# EAGLE design EVE v0-3 (EAGLE 6.1)
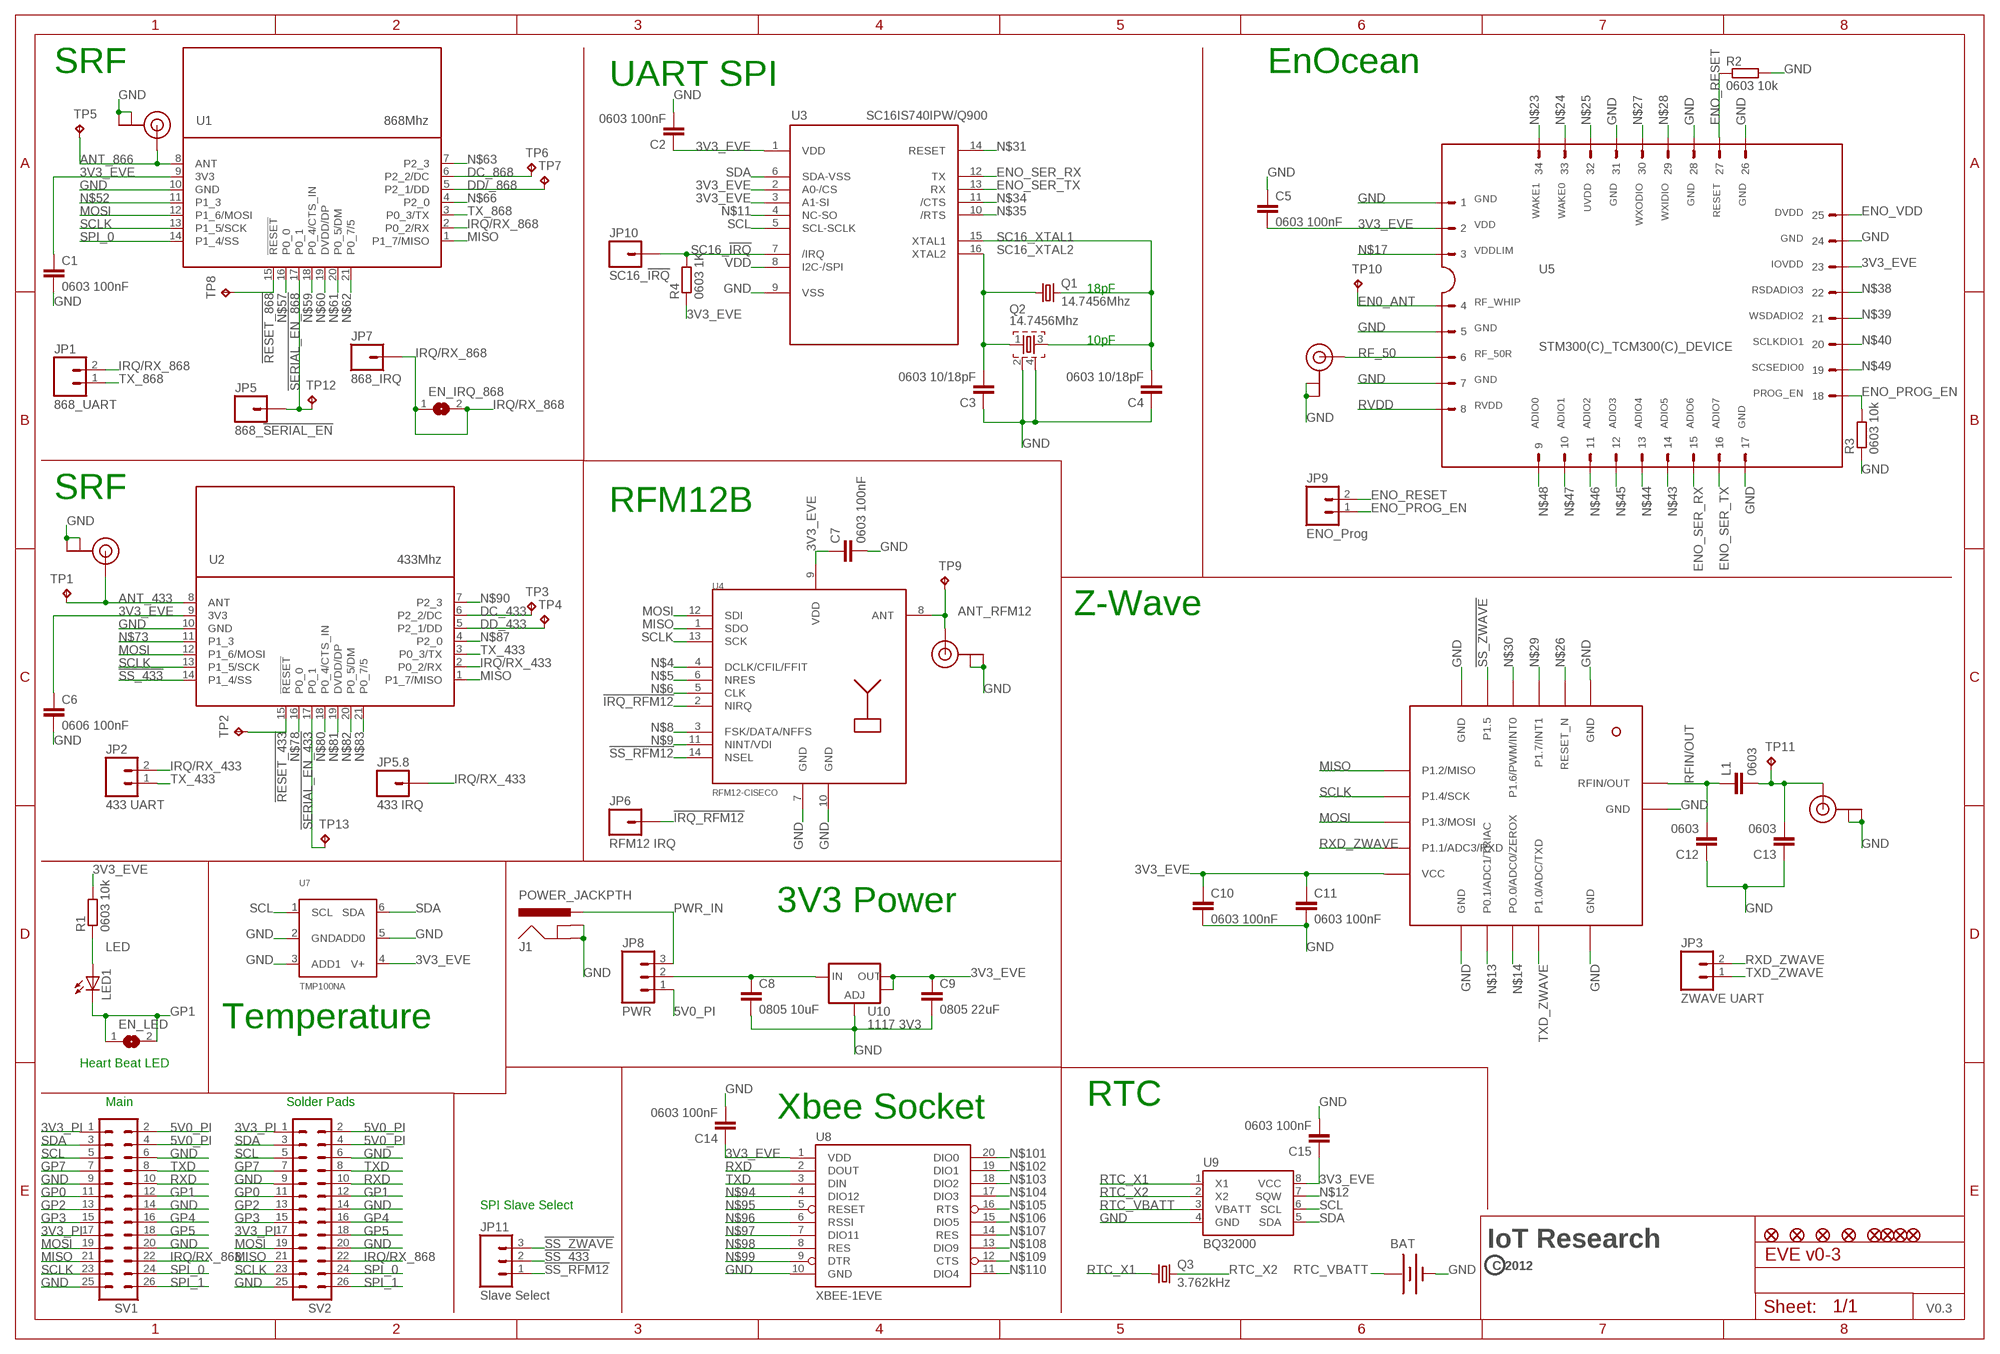
[diagram p0: schematic, sheet 1]

## Parts
BAT  BATTERY12MM-BK-855  [BATTCON_12MM-BK-885]
C1  0603 100nF  C-EUC0603K-SMALL  [C0603K-SMALL]
C2  0603 100nF  C-EUC0603K-SMALL  [C0603K-SMALL]
C3  0603 10/18pF  C-EUC0603K-SMALL  [C0603K-SMALL]
C4  0603 10/18pF  C-EUC0603K-SMALL  [C0603K-SMALL]
C5  0603 100nF  C-EUC0603K-SMALL  [C0603K-SMALL]
C6  0606 100nF  C-EUC0603K-SMALL  [C0603K-SMALL]
C7  0603 100nF  C-EUC0603K-SMALL  [C0603K-SMALL]
C8  0805 10uF  C-EUC0805  [C0805]
C9  0805 22uF  C-EUC0805  [C0805]
C10  0603 100nF  C-EUC0603K-SMALL  [C0603K-SMALL]
C11  0603 100nF  C-EUC0603K-SMALL  [C0603K-SMALL]
C12  0603  C-EUC0603K-SMALL  [C0603K-SMALL]
C13  0603  C-EUC0603K-SMALL  [C0603K-SMALL]
C14  0603 100nF  C-EUC0603K-SMALL  [C0603K-SMALL]
C15  0603 100nF  C-EUC0603K-SMALL  [C0603K-SMALL]
EN_IRQ_868  SJ  [SJ]
EN_LED  SJ  [SJ]
J1  POWER_JACKPTH  [POWER_JACK_PTH]
JP1  868_UART  M021X02_NO_SILK  [1X02_NO_SILK]
JP2  433 UART  M021X02_NO_SILK  [1X02_NO_SILK]
JP3  ZWAVE UART  M021X02_NO_SILK  [1X02_NO_SILK]
JP4  FIDUCIAL1X2-STOP  [FIDUCIAL-1X2-STOP]
JP5  868_!SERIAL_EN  M01SMDNS  [1X01NS]
JP5.8  433 IRQ  M01SMDNS  [1X01NS]
JP6  RFM12 IRQ  M01SMDNS  [1X01NS]
JP7  868_IRQ  M01SMDNS  [1X01NS]
JP8  PWR  M031X03_NO_SILK  [1X03_NO_SILK]
JP9  ENO_Prog  M021X02_NO_SILK  [1X02_NO_SILK]
JP10  SC16_!IRQ  M01SMDNS  [1X01NS]
JP11  Slave Select  M031X03_NO_SILK  [1X03_NO_SILK]
JP12  FIDUCIAL1X2-STOP  [FIDUCIAL-1X2-STOP]
JP13  FIDUCIAL1X2-STOP  [FIDUCIAL-1X2-STOP]
JP14  FIDUCIAL1X2-STOP  [FIDUCIAL-1X2-STOP]
JP15  FIDUCIAL1X2-STOP  [FIDUCIAL-1X2-STOP]
JP16  FIDUCIAL1X2-STOP  [FIDUCIAL-1X2-STOP]
JP17  FIDUCIAL1X2-STOP  [FIDUCIAL-1X2-STOP]
JP18  FIDUCIAL1X2-STOP  [FIDUCIAL-1X2-STOP]
L1  0603  C-EUC0603K-SMALL  [C0603K-SMALL]
LED1  LEDREVERSE  [LED-REVERSE]
Q1  14.7456Mhz  CRYSTAL10.5X4.8  [CRYSTAL-SMD-10.5X4.8-2PIN]
Q2  14.7456Mhz  CRYSTAL-SMD  [CRYSTAL-SMD-ABM8G]
Q3  3.762kHz  MC-306  [MC-306]
R1  0603 10k  R-EU_0603K-SMALL  [C0603K-SMALL]
R2  0603 10k  R-EU_0603K-SMALL  [C0603K-SMALL]
R3  0603 10k  R-EU_0603K-SMALL  [C0603K-SMALL]
R4  0603 1K  R-EU_0603K-SMALL  [C0603K-SMALL]
SV1  MA13-2-NO-SILK  [MA13-2-NS]
SV2  MA13-2  [MA13-2]
TP1  TPPAD1-13  [P1-13]
TP2  TPB1,27  [B1,27]
TP3  TPB1,27  [B1,27]
TP4  TPB1,27  [B1,27]
TP5  TPPAD1-13  [P1-13]
TP6  TPB1,27  [B1,27]
TP7  TPB1,27  [B1,27]
TP8  TPB1,27  [B1,27]
TP9  TPPAD1-13  [P1-13]
TP10  TPPAD1-13  [P1-13]
TP11  TPPAD1-13  [P1-13]
TP12  TPB1,27  [B1,27]
TP13  TPB1,27  [B1,27]
U1  868Mhz  SRFSRF-LANDING  [SRF-LANDING]
U2  433Mhz  SRFSRF-LANDING-NO-ANT  [SRF-LANDING-NO-ANT]
U3  SC16IS740IPW/Q900  [TSSOP-16]
U4  RFM12-CISECO  [RFM-CISECO]
U5  STM300(C)_TCM300(C)_DEVICE  [STM300(C)_TCM300(C)_FOOTPRINT]
U6  ZWAVE-ZM3102N  [ZWAVE-ZM3102N]
U7  TMP100NA  TMP100"  [SOT-23-6]
U8  XBEE-1EVE  [XBEE-EVE]
U9  BQ32000  DS1307SO8  [SO08]
U10  1117 3V3  V_REG_LM1117SOT223  [SOT223]
U11  U.FL 868  U.FL  [U.FL]
U12  U.FL EnOcean  U.FL  [U.FL]
U13  U.FL 433  U.FL  [U.FL]
U14  U.FL RFM12B  U.FL  [U.FL]
U15  U.FL Z-Wave  U.FL  [U.FL]

## Nets
3V3_EVE [3V3_EVE]: C1.1 C2.1 C5.2 C6.1 C7.1 C9.1 C10.1 C11.1 C14.1 C15.1 R1.2 R4.1 U1.9(3V3) U2.9(3V3) U3.1(VDD) U3.2(A0-/CS) U3.3(A1-SI) U4.9(VDD) U5.2 U5.23 U6.11(VCC) U7.4(V+) U8.1(VDD) U9.8(VCC) U10.2(OUT) U10.4(OUT)
3V3_PI [3V3_PI]: SV1.1 SV1.17 SV2.1 SV2.17
5V0_PI [5V0_PI]: JP8.1 SV1.2 SV1.4 SV2.2 SV2.4
!IRQ_RFM12: JP6.1 U4.2(NIRQ)
!RESET_433: TP2.TP U2.15(!RESET)
!RESET_868: TP8.TP U1.15(!RESET)
!SERIAL_EN_433: TP13.TP U2.17(P0_1)
!SERIAL_EN_868: JP5.1 TP12.TP U1.17(P0_1)
!SS_433: JP11.2 U2.14(P1_4/SS)
!SS_RFM12: JP11.1 U4.14(NSEL)
!SS_ZWAVE: JP11.3 U6.5(P1.5)
ANT_433: TP1.TP U2.8(ANT) U13.P$3(SIGNAL)
ANT_866: TP5.TP U1.8(ANT) U11.P$3(SIGNAL)
ANT_RFM12: TP9.TP U4.8(ANT) U14.P$3(SIGNAL)
DC_433: TP3.TP U2.6(P2_2/DC)
DC_868: TP6.TP U1.6(P2_2/DC)
DD/_868: TP7.TP U1.5(P2_1/DD)
DD_433: TP4.TP U2.5(P2_1/DD)
EN0_ANT: TP10.TP U5.4
ENO_PROG_EN: JP9.1 R3.2 U5.18
ENO_RESET: JP9.2 R2.1 U5.27
ENO_SER_RX: U3.12(TX) U5.15
ENO_SER_TX: U3.13(RX) U5.16
ENO_VDD: U5.25
GND: BAT.GND(-) C1.2 C2.2 C3.1 C4.1 C5.1 C6.2 C7.2 C8.2 C9.2 C10.2 C11.2 C12.1 C13.1 C14.2 C15.2 J1.GND J1.GNDBREAK Q2.2 Q2.4 R2.2 R3.1 SV1.6 SV1.9 SV1.14 SV1.20 SV1.25 SV2.6 SV2.9 SV2.14 SV2.20 SV2.25 U1.10(GND) U2.10(GND) U3.9(VSS) U4.7(GND) U4.10(GND) U5.1 U5.5 U5.7 U5.17 U5.24 U5.26 U5.28 U5.31 U6.1(GND) U6.6(GND) U6.12(GND) U6.16(GND) U6.17(GND) U7.2(GND) U7.3(ADD1) U7.5(ADD0) U8.10(GND) U9.4(GND) U10.1(ADJ) U11.P$1(GND) U11.P$2(GND) U12.P$1(GND) U12.P$2(GND) U13.P$1(GND) U13.P$2(GND) U14.P$1(GND) U14.P$2(GND) U15.P$1(GND) U15.P$2(GND)
GP0: SV1.11 SV2.11
GP1: EN_LED.1 EN_LED.2 LED1.C SV1.12 SV2.12
GP2: SV1.13 SV2.13
GP3: SV1.15 SV2.15
GP4: SV1.16 SV2.16
GP5: SV1.18 SV2.18
GP7: SV1.7 SV2.7
IRQ/RX_433: JP2.2 JP5.8.1 U2.2(P0_2/RX)
IRQ/RX_868: EN_IRQ_868.1 EN_IRQ_868.2 JP1.2 JP7.1 SV1.22 SV2.22 U1.2(P0_2/RX)
LED: LED1.A R1.1
MISO: SV1.21 SV2.21 U1.1(P1_7/MISO) U2.1(P1_7/MISO) U4.1(SDO) U6.7(P1.2/MISO)
MOSI: SV1.19 SV2.19 U1.12(P1_6/MOSI) U2.12(P1_6/MOSI) U4.12(SDI) U6.9(P1.3/MOSI)
N$3: C13.2 L1.2 TP11.TP U15.P$3(SIGNAL)
N$4: U4.4(DCLK/CFIL/FFIT)
N$5: U4.6(NRES)
N$6: U4.5(CLK)
N$8: U4.3(FSK/DATA/NFFS)
N$9: U4.11(NINT/VDI)
N$11: U3.4(NC-SO)
N$12: U9.7(SQW)
N$13: U6.13(P0.1/ADC1/TRIAC)
N$14: U6.14(PO.0/ADC0/ZEROX)
N$17: U5.3
N$23: U5.34
N$24: U5.33
N$25: U5.32
N$26: U6.2(RESET_N)
N$27: U5.30
N$28: U5.29
N$29: U6.3(P1.7/INT1)
N$30: U6.4(P1.6/PWM/INT0)
N$31: U3.14(RESET)
N$34: U3.11(/CTS)
N$35: U3.10(/RTS)
N$38: U5.22
N$39: U5.21
N$40: U5.20
N$43: U5.14
N$44: U5.13
N$45: U5.12
N$46: U5.11
N$47: U5.10
N$48: U5.9
N$49: U5.19
N$52: U1.11(P1_3)
N$57: U1.16(P0_0)
N$59: U1.18(P0_4/CTS_IN)
N$60: U1.19(DVDD/DP)
N$61: U1.20(P0_5/DM)
N$62: U1.21(P0_7/5)
N$63: U1.7(P2_3)
N$66: U1.4(P2_0)
N$73: U2.11(P1_3)
N$78: U2.16(P0_0)
N$80: U2.18(P0_4/CTS_IN)
N$81: U2.19(DVDD/DP)
N$82: U2.20(P0_5/DM)
N$83: U2.21(P0_7/5)
N$87: U2.4(P2_0)
N$90: U2.7(P2_3)
N$94: U8.4(DIO12)
N$95: U8.5(RESET)
N$96: U8.6(RSSI)
N$97: U8.7(DIO11)
N$98: U8.8(RES)
N$99: U8.9(DTR)
N$101: U8.20(DIO0)
N$102: U8.19(DIO1)
N$103: U8.18(DIO2)
N$104: U8.17(DIO3)
N$105: U8.16(RTS)
N$106: U8.15(DIO5)
N$107: U8.14(RES)
N$108: U8.13(DIO9)
N$109: U8.12(CTS)
N$110: U8.11(DIO4)
PWR_IN [PWR_IN]: J1.PWR JP8.3
RF_50: U5.6 U12.P$3(SIGNAL)
RFIN/OUT: C12.2 L1.1 U6.18(RFIN/OUT)
RTC_VBATT: BAT.PWR@2(+) U9.3(VBATT)
RTC_X1: Q3.1 U9.1(X1)
RTC_X2: Q3.4 U9.2(X2)
RVDD: U5.8
RXD: SV1.10 SV2.10 U8.2(DOUT)
RXD_ZWAVE: JP3.2 U6.10(P1.1/ADC3/RXD)
SC16_!IRQ: JP10.1 R4.2 U3.7(/IRQ)
SC16_XTAL1: C4.2 Q1.P$2 Q2.3 U3.15(XTAL1)
SC16_XTAL2: C3.2 Q1.P$1 Q2.1 U3.16(XTAL2)
SCL: SV1.5 SV2.5 U3.5(SCL-SCLK) U7.1(SCL) U9.6(SCL)
SCLK: SV1.23 SV2.23 U1.13(P1_5/SCK) U2.13(P1_5/SCK) U4.13(SCK) U6.8(P1.4/SCK)
SDA: SV1.3 SV2.3 U3.6(SDA-VSS) U7.6(SDA) U9.5(SDA)
SPI_0: SV1.24 SV2.24 U1.14(P1_4/SS)
SPI_1: SV1.26 SV2.26
TX_433: JP2.1 U2.3(P0_3/TX)
TX_868: JP1.1 U1.3(P0_3/TX)
TXD: SV1.8 SV2.8 U8.3(DIN)
TXD_ZWAVE: JP3.1 U6.15(P1.0/ADC/TXD)
VCC_EVE [VCC_EVE]: C8.1 JP8.2 U10.3(IN)
VDD: U3.8(I2C-/SPI)

## Notes on the sheet
- SRF | EnOcean
- UART SPI
- 18pF
- 10pF
- SRF
- RFM12B
- Z-Wave
- 3V3 Power
- Temperature
- Heart Beat LED
- Main | Solder Pads | RTC
- Xbee Socket
- SPI Slave Select
- IoT Research
- C 2012
- V0.3

## Library data of the parts
BAT = CISECO eaglecad designs:BATTERY: Battery Holders Various common sizes : AA, AAA, 20mm coin cell and 12mm coin cell.
C1-C15 L1 = CISECO eaglecad designs:C-EU: CAPACITOR, European symbol
EN_IRQ_868 EN_LED = jumper:SJ: SMD solder JUMPER
J1 = SparkFunJan12:POWER_JACK: Power Jack This is the standard 5.5mm barrel jack for power. The PTH is the most common, proven, reliable, footprint. All others are experimental. The Slot footprint only works if the mill layer is transmitted to the PCB fab house so be warned. Spark Fun Electronics SKU : PRT-00119. Mating wall wart : TOL-00298 (and others)
JP1-JP3 JP9 = SparkFunJan12:M02: Header 2 Standard 2-pin 0.1" header. Use with straight break away headers (SKU : PRT-00116), right angle break away headers (PRT-00553), swiss pins (PRT-00743), machine pins (PRT-00117), and female headers (PRT-00115). Molex polarized connector foot print use with SKU : PRT-08233 with associated crimp pins and housings.
JP4 JP12-JP18 = CISECO eaglecad designs:FIDUCIAL: Fiducial Alignment Points Various fiducial points for machine vision alignment.
JP5 JP5.8 JP6 JP7 JP10 = SparkFunJan12:M01: Header 1 Standard 1-pin 0.1" header. Use with straight break away headers (SKU : PRT-00116), right angle break away headers (PRT-00553), swiss pins (PRT-00743), machine pins (PRT-00117), and female headers (PRT-00115).
JP8 JP11 = SparkFunJan12:M03: Header 3 Standard 3-pin 0.1" header. Use with straight break away headers (SKU : PRT-00116), right angle break away headers (PRT-00553), swiss pins (PRT-00743), machine pins (PRT-00117), and female headers (PRT-00115). Molex polarized connector foot print use with SKU : PRT-08232 with associated crimp pins and housings.
LED1 = CISECO eaglecad designs:LED: LEDs Standard schematic elements and footprints for 5mm, 3mm, 1206, and 0603 sized LEDs. 5mm - Spark Fun Electronics SKU : COM-00529 (and others)
Q1 = CISECO eaglecad designs:CRYSTAL: Crystals Various standard crystals. Proven footprints. Spark Fun Electronics SKU : COM-00534
Q2 = CISECO eaglecad designs:CRYSTAL-SMD
Q3 = crystal:MC-306: kHz RANGE CRYSTAL UNIT SMD Source: MC-306_405_406_E07X.PDF Homepage <http://www.epsontoyocom.co.jp>; MPN: MC-306 60.0KHZ 100PPM ,12.5PF; OC_FARNELL: 1278040; OC_NEWARK: 31M5576
R1-R4 = CISECO eaglecad designs:R-EU_: RESISTOR, European symbol
SV1 = CISECO eaglecad designs:MA13-2: PIN HEADER
SV2 = CISECO eaglecad designs:MA13-2: PIN HEADER; OC_FARNELL: unknown; OC_NEWARK: unknown
TP1-TP13 = testpad:TP: Test pad
U1 U2 = Ciseco Footprints:SRF: SRF Wireless UART Serial Data Module. www.ciseco.co.uk
U3 = CISECO eaglecad designs:SC16IS740
U4 = Pollin_RFMxx:RFM12
U5 = STM300(C)_TCM300(C)_Eagle_Footprint:STM300(C)_TCM300(C)_DEVICE
U6 = CISECO eaglecad designs:ZWAVE-ZM3102N
U7 = CISECO eaglecad designs:TMP100
U8 = SparkFunJan12:XBEE-1
U9 = SparkFunJan12:DS1307
U10 = SparkFunJan12:V_REG_LM1117: Voltage Regulator LM1117 Standard adjustable voltage regulator but in SMD form. Spark Fun Electronics SKU : COM-00595
U11-U15 = CISECO eaglecad designs:U.FL

## Net classes
0 default: width 0.15 mm, drill 0.3 mm
1 3V3_EVE: width 0.254 mm, drill 0.3 mm
2 VCC_EVE: width 0.61 mm, drill 0.4 mm
3 5V0_PI: width 0.406 mm, drill 0.4 mm
4 3V3_PI: width 0.254 mm, drill 0.4 mm
5 PWR_IN: width 0.61 mm
6 RTC_VBATT: width 0.254 mm

## Board
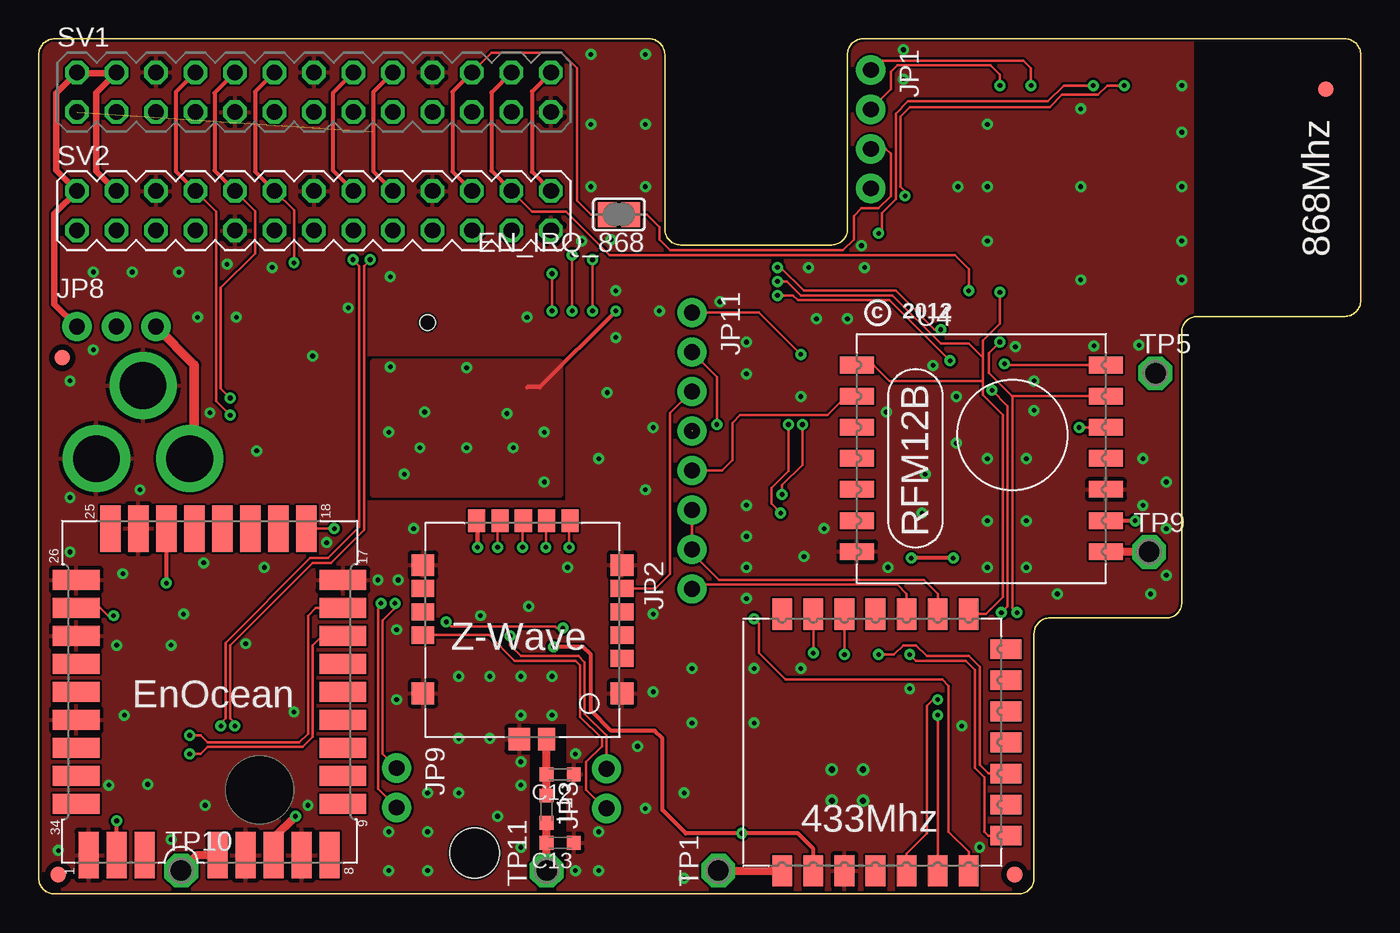
[diagram p1: board, top side]
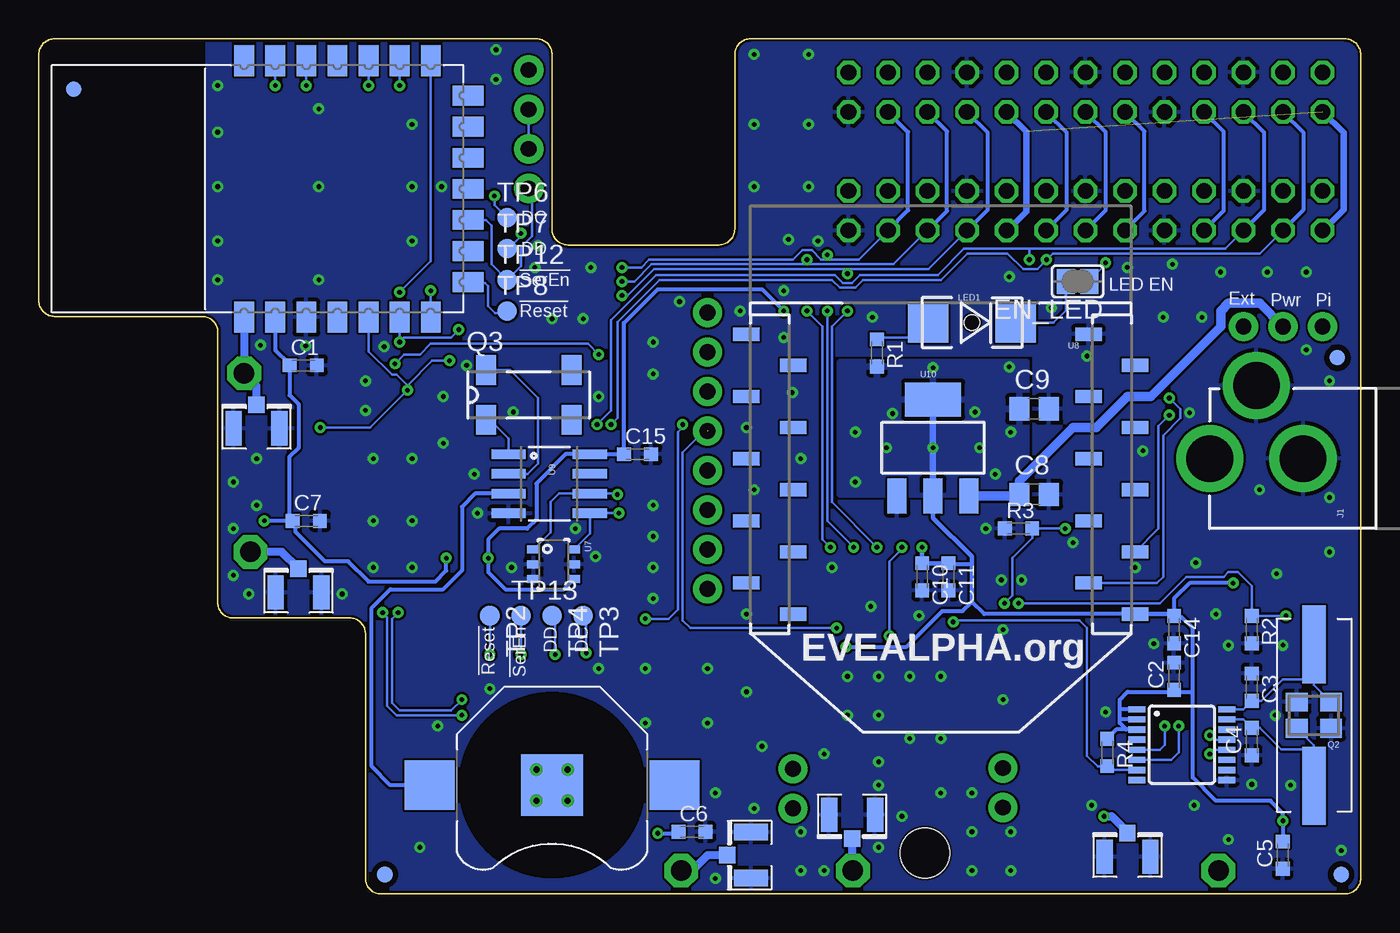
[diagram p2: board, bottom side, seen from below]

Size 85 x 55 mm. Coordinates in mm from the lower left corner, seen from the top.
Outline: 1,55 39.25,55 arc-90 40.25,54 40.25,42.75 arc90 41.25,41.75 51,41.75 arc90 52,42.75 52,54 arc-90 53,55 84,55 arc-90 85,54 85,38.15 arc-90 84,37.15 74.5,37.15 arc90 73.5,36.15 73.5,18.75 arc-90 72.5,17.75 65,17.75 arc90 64,16.75 64,1 arc-90 63,0 1,0 arc-90 0,1 0,54 arc-90 1,55
Copper layers (1*16): Top 0.035mm / dielectric 1mm / Bottom 0.035mm
Design rules: minimum track width 0.15mm, minimum drill 0.3mm, track to track 0.15mm, track to pad 0.15mm, pad to pad 0.15mm, via to via 0.15mm, smd to smd 0.15mm, copper to edge 0.15mm, drill to drill 0.15mm, minimum pad ring 10mil, minimum via ring 8mil, stop-mask expansion 4mil, vias tented up to drill 23mil, thermal gap 10mil
Holes 3.2 mm at 28.02,2.64
Holes 1 mm at 25,36.75
tRestrict: area 74.3,37.1 to 84.5,54.7; area 31.6,1.3 to 33.9,10.9
bRestrict: area 74.3,37.1 to 84.5,54.7; area 46,1 to 58,13

### Footprints (pad centres in the part's own frame; a part is rotated, then mirrored left to right if it is on the bottom)
BATTCON_12MM-BK-885 = smd 3.962 x 3.962: GND 0,0 | smd 3.2 x 3.2: PWR@1 -7.874,0; PWR@2 7.874,0
C0603K-SMALL = smd 0.889 x 0.889: 1 -0.875,0; 2 0.875,0
C0805 = smd 1.3 x 1.5: 1 -0.95,0; 2 0.95,0
SJ = smd 1.168 x 1.6: 1 -0.762,0; 2 0.762,0
POWER_JACK_PTH = drill 2.997 pad 4.318: GND 0,7.7; GNDBREAK 4.7,10.7; PWR 0,13.7
1X02_NO_SILK = drill 1.016 pad 1.88: 1 0,0; 2 2.54,0
FIDUCIAL-1X2-STOP = smd 1 x 1: 1 0,0
1X01NS = drill 1.016 pad 1.88: 1 0,0
1X03_NO_SILK = drill 1.016 pad 1.88: 1 0,0; 2 2.54,0; 3 5.08,0
LED-REVERSE = smd 2.6 x 2.6: A -2.8,0; C 2.8,0
CRYSTAL-SMD-10.5X4.8-2PIN = smd 5 x 1.5: P$1 -4.55,0; P$2 4.55,0
CRYSTAL-SMD-ABM8G = smd 1.4 x 1.2: 1 -1.1,-0.85; 2 1.1,-0.85; 3 1.1,0.85; 4 -1.1,0.85
MC-306 = smd 1.3 x 1.9: 1 -2.75,-1.6; 2 2.75,-1.6; 3 2.75,1.6; 4 -2.75,1.6
MA13-2-NS = drill 1.016 octagon: 1 -15.24,-1.27; 2 -15.24,1.27; 3 -12.7,-1.27; 4 -12.7,1.27; 5 -10.16,-1.27; 6 -10.16,1.27; 7 -7.62,-1.27; 8 -7.62,1.27; 9 -5.08,-1.27; 10 -5.08,1.27; 11 -2.54,-1.27; 12 -2.54,1.27; 13 0,-1.27; 14 0,1.27; 15 2.54,-1.27; 16 2.54,1.27; 17 5.08,-1.27; 18 5.08,1.27; 19 7.62,-1.27; 20 7.62,1.27; 21 10.16,-1.27; 22 10.16,1.27; 23 12.7,-1.27; 24 12.7,1.27; 25 15.24,-1.27; 26 15.24,1.27
MA13-2 = drill 1.016 octagon: 1 -15.24,-1.27; 2 -15.24,1.27; 3 -12.7,-1.27; 4 -12.7,1.27; 5 -10.16,-1.27; 6 -10.16,1.27; 7 -7.62,-1.27; 8 -7.62,1.27; 9 -5.08,-1.27; 10 -5.08,1.27; 11 -2.54,-1.27; 12 -2.54,1.27; 13 0,-1.27; 14 0,1.27; 15 2.54,-1.27; 16 2.54,1.27; 17 5.08,-1.27; 18 5.08,1.27; 19 7.62,-1.27; 20 7.62,1.27; 21 10.16,-1.27; 22 10.16,1.27; 23 12.7,-1.27; 24 12.7,1.27; 25 15.24,-1.27; 26 15.24,1.27
P1-13 = drill 1.321 pad 2.159 octagon: TP 0,0
B1,27 = smd 1.27 x 1.27: TP 0,0
SRF-LANDING = smd 2 x 1.27: 1 16.2,2; 2 16.2,4; 3 16.2,6; 4 16.2,8; 5 16.2,10; 6 16.2,12; 7 16.2,14; 8 -0.3,14; 9 -0.3,12; 10 -0.3,10; 11 -0.3,8; 12 -0.3,6; 13 -0.3,4; 14 -0.3,2 | smd 1.27 x 2: 15 1.95,-0.4; 16 3.95,-0.4; 17 5.95,-0.4; 18 7.95,-0.4; 19 9.95,-0.4; 20 11.95,-0.4; 21 13.95,-0.4
SRF-LANDING-NO-ANT = smd 2 x 1.27: 1 16.2,2; 2 16.2,4; 3 16.2,6; 4 16.2,8; 5 16.2,10; 6 16.2,12; 7 16.2,14; 8 -0.3,14; 9 -0.3,12; 10 -0.3,10; 11 -0.3,8; 12 -0.3,6; 13 -0.3,4; 14 -0.3,2 | smd 1.27 x 2: 15 1.95,-0.4; 16 3.95,-0.4; 17 5.95,-0.4; 18 7.95,-0.4; 19 9.95,-0.4; 20 11.95,-0.4; 21 13.95,-0.4
TSSOP-16 = smd 0.4 x 1.1: 1 -2.275,-2.9; 2 -1.625,-2.9; 3 -0.975,-2.9; 4 -0.325,-2.9; 5 0.325,-2.9; 6 0.975,-2.9; 7 1.625,-2.9; 8 2.275,-2.9; 9 2.275,2.9; 10 1.625,2.9; 11 0.975,2.9; 12 0.325,2.9; 13 -0.325,2.9; 14 -0.975,2.9; 15 -1.625,2.9; 16 -2.275,2.9
RFM-CISECO = smd 2.184 x 1.067: 1 0,14; 2 0,12; 3 0,10; 4 0,8; 5 0,6; 6 0,4; 7 0,2; 8 16,2; 9 16,4; 10 16,6; 11 16,8; 12 16,10; 13 16,12; 14 16,14
STM300(C)_TCM300(C)_FOOTPRINT = smd 3 x 1.3: 1 21.5,1.7; 2 21.5,3.5; 3 21.5,5.3; 4 21.5,10; 5 21.5,11.8; 6 21.5,13.6; 7 21.5,15.4; 8 21.5,17.2; 18 0.5,15.7; 19 0.5,13.9; 20 0.5,12.1; 21 0.5,10.3; 22 0.5,8.5; 23 0.5,6.7; 24 0.5,4.9; 25 0.5,3.1 | smd 1.3 x 3: 9 18.2,18.05; 10 16.4,18.05; 11 14.6,18.05; 12 12.8,18.05; 13 11,18.05; 14 9.2,18.05; 15 7.4,18.05; 16 5.6,18.05; 17 3.8,18.05; 26 3.8,0.9; 27 5.6,0.9; 28 7.4,0.9; 29 9.2,0.9; 30 11,0.9; 31 12.8,0.9; 32 14.6,0.9; 33 16.4,0.9; 34 18.2,0.9
ZWAVE-ZM3102N = smd 1.4 x 1.45: 1 11.8,13.5; 6 3.55,13.5; 12 3.55,0.7; 16 11.8,0.7 | smd 1.1 x 1.45: 2 9.55,13.5; 3 8.05,13.5; 4 6.55,13.5; 5 5.05,13.5; 13 5.05,0.7; 14 6.55,0.7; 15 8.05,0.7 | smd 1.45 x 1.1: 7 0.7,10.15; 8 0.7,8.65; 9 0.7,7.15; 10 0.7,5.65; 11 0.7,4.15; 18 14.75,8.65 | smd 1.45 x 1.4: 17 14.75,6.9
SOT-23-6 = smd 0.51 x 0.8: 1 -0.95,-1.3; 2 0,-1.3; 3 0.95,-1.3; 4 0.95,1.3; 5 0,1.3; 6 -0.95,1.3
XBEE-EVE = smd 1.7 x 0.85: 1 -12.5,20; 2 -9.5,18; 3 -12.5,16; 4 -9.5,14; 5 -12.5,12; 6 -9.5,10; 7 -12.5,8; 8 -9.5,6; 9 -12.5,4; 10 -9.5,2; 11 12.5,2; 12 9.5,4; 13 12.5,6; 14 9.5,8; 15 12.5,10; 16 9.5,12; 17 12.5,14; 18 9.5,16; 19 12.5,18; 20 9.5,20
SO08 = smd 0.61 x 2.21: 1 -1.905,-2.616; 2 -0.635,-2.616; 3 0.635,-2.616; 4 1.905,-2.616; 5 1.905,2.616; 6 0.635,2.616; 7 -0.635,2.616; 8 -1.905,2.616
SOT223 = smd 1.219 x 2.235: 1 -2.311,-3.099; 2 0,-3.099; 3 2.311,-3.099 | smd 3.6 x 2.2: 4 0,3.099
U.FL = smd 2.2 x 1.05: P$1 0,1.475; P$2 0,-1.475 | smd 1.05 x 1.05: P$3 1.525,0

### Placement (x,y rotation side)
BAT  52,7 180 bottom
C1  68,34 0 bottom
C2  12,14 90 bottom
C3  7,13.3 270 bottom
C4  7,9.8 90 bottom
C5  5,2.5 90 bottom
C6  43,4 0 bottom
C7  67.8,24 0 bottom
C8  21,25.7 0 bottom
C9  21,31.2 0 bottom
C10  28.2,20.4 270 bottom
C11  26.5,20.4 270 bottom
C12  33.52,7.7 180 top
C13  33.52,3.3 180 top
C14  12,17 270 bottom
C15  46.5,28.29 0 bottom
EN_IRQ_868  37.3,43.7 180 top
EN_LED  18.2,39.4 180 bottom
J1  -4,28 90 bottom
JP1  53.5,53 270 top
JP2  42,19.62 90 top
JP3  36.5,5.5 90 top
JP4  1.25,1.25 0 top
JP5  53.5,45.38 0 top
JP5.8  42,24.7 0 top
JP6  42,27.24 0 top
JP7  53.5,47.92 0 top
JP8  2.45,36.5 0 top
JP9  23,8.1 270 top
JP10  42,29.78 0 top
JP11  42,37.4 270 top
JP12  82.75,51.75 0 top
JP13  1.5,34.5 0 bottom
JP14  62.75,1.25 0 bottom
JP15  62.75,1.25 0 top
JP16  1.25,1.25 0 bottom
JP17  1.5,34.5 0 top
JP18  82.75,51.75 0 bottom
L1  32.65,5.45 270 top
LED1  25,36.75 0 bottom
Q1  3,11.5 270 bottom
Q2  3,11.5 180 bottom
Q3  53.5,32.1 0 bottom
R1  31.1,34.8 270 bottom
R2  7,17 270 bottom
R3  22,23.5 0 bottom
R4  16.3,9.1 270 bottom
SV1  17.69,51.57 0 top
SV2  17.69,43.95 0 top
TP1  43.7,1.5 90 top
TP2  56,17.9 270 bottom
TP3  50,17.9 270 bottom
TP4  52,17.9 270 bottom
TP5  71.8,33.5 0 top
TP6  54.9,43.5 0 bottom
TP7  54.9,41.5 0 bottom
TP8  54.9,37.5 0 bottom
TP9  71.4,22 0 top
TP10  9.15,1.5 0 top
TP11  32.65,1.5 90 top
TP12  54.9,39.5 0 bottom
TP13  54,17.9 0 bottom
U1  57.8,37.4 90 bottom
U2  61.8,1.8 90 top
U3  11.5,9.6 270 bottom
U4  52.62,20.02 0 top
U5  1.5,24 270 top
U6  24,24.7 270 top
U7  51.9,21.2 270 bottom
U8  27,38 180 bottom
U9  52.18,26.38 270 bottom
U10  27.5,28.7 0 bottom
U11  71,29.95 90 bottom
U12  15,2.4 90 bottom
U13  39.2,2.5 180 bottom
U14  68.3,19.4 90 bottom
U15  32.7,5.1 270 bottom
U$8  [EVE1]  25,37.5 0 top

### Tracks (layer width: path | path; a pad name or v marks a point on that pad's centre or on a via)
3V3_EVE  (via drill 0.3)
  Top 0.254: U2.9 49.8,2.9 48.8,3.9 v45.2,3.9 41.6,3.9 40.1,5.4 40.1,10 39.6,10.5 36.8,10.5 35.5,11.8 35.5,15.4 35,15.9 v33.1,15.9 | U5.2 v5,4.7 | U4.9 70.48,24.02 v70.5,24 | v58.8,21.6 v56.1,21.6 | v37.1,37.5 32.2,32.6 31.4,32.6 | U5.23 v8.2,20
  Top 0.305: U6.11 28.2,23.95 v28.2,22.3
  Bottom 0.254: C5.2 v5,4.7 5,5.2 5.8,6 9.3,6 10.8,7.5 10.8,13 | C7.1 v70.5,24 | U8.1 24.2,18 25,18.8 25.6,18.2 26.9,18.2 29.2,15.9 v33.1,15.9 | 10.8,13 10.8,17.1 11.5,17.8 12,17.8 C14.1 12,19 11,20 v8.2,20 | U1.9 69.8,35 68.88,34.08 C1.1 68.88,32.08 68.3,31.5 68.3,28.7 68.9,28.1 68.9,24 C7.1 | C7.1 68.5,23.82 68.5,23.3 66.6,21.4 65.1,21.4 63.8,20.1 59.5,20.1 58.8,20.8 v58.8,21.6 | U7.4 51.25,19.6 55,19.6 56.1,20.7 v56.1,21.6 56.1,22.8 55.4,23.5 53.6,23.5 53,24.1 53,26.4 51.12,28.29 U9.8 C15.1 47.38,36.73 45.2,38.9 38.5,38.9 v37.1,37.5 | 15.5,11.2 15.5,11 15.07,10.57 | 15.5,11.2 15.5,11.9 | 15.5,11.9 15.5,12.5 15,13 12,13 | 12,13 10.8,13 | C2.1 12,13 | 15.07,10.57 15.7,10.57 R4.1 | U3.3 15.07,10.57 | U3.2 15.47,11.22 15.5,11.2 | 25,21.2 26.4,21.2 26.48,21.27 C11.1 | U3.1 15.47,11.88 15.5,11.9 | v45.2,3.9 43.98,3.9 C6.1
  Bottom 0.305: U8.1 12.12,18 C14.1 | C11.1 C10.1 v28.2,22.3 | U10.2 27.5,24.2 25,21.7 25,21.2 25,18.8
  Bottom 0.406: U10.4 27.5,25.7
  other vias: 27.5,28.7 24.8,31 30.1,30.9 27.5,33.85 23.5,27 22.5,29.7 22.6,33.9 32.5,29.7 32.5,26.5 30.5,28.7 24.5,28.7
  pour Bottom: 21.5,25.7 33.5,25.7 33.5,34.2 21.5,34.2
  pour Top: 33.5,25.7 21.5,25.7 21.5,34.2 33.5,34.2
3V3_PI  (1 unrouted)
  Bottom 0.406: SV1.1 1.1,48.95 1.1,44.03 SV2.1 | SV2.17 22.72,42.68 21.5,43.9 21.5,49.03 SV1.17
5V0_PI
  Top 0.406: JP8.1 1,37.95 1,43.77 SV2.2 1.1,46.57 1.1,51.49 SV1.2 2.49,52.8 4.95,52.8 SV1.4 3.7,51.55 3.7,46.5 SV2.4
!IRQ_RFM12
  Top 0.15: U4.2 52.6,32 51.9,32 50.7,30.8 45.1,30.8 44.6,30.3 44.6,27.9 43.94,27.24 JP6.1
!RESET_433  (via drill 0.3)
  Top 0.15: U2.15 61.05,3.75 60.8,4 60.8,7.5 60.2,8.1 60.2,14.4 59.6,15 56.4,15 v56,15.4
  Bottom 0.15: v56,15.4 TP2.TP
!RESET_868
  Bottom 0.15: TP8.TP 55.05,37.35 55.65,37.35 56.1,37.8 56.1,39.1 56.3,39.3 57.35,39.3 U1.15
!SERIAL_EN_433  (via drill 0.3)
  Top 0.15: U2.17 61.05,7.75 60.5,8.3 60.5,14.6 59.8,15.3 57.1,15.3 56.4,16 55.6,16 55,15.4 v54,15.4
  Bottom 0.15: v54,15.4 TP13.TP
!SERIAL_EN_868
  Bottom 0.15: U1.17 56.25,43.35 55.9,43 55.9,40.5 TP12.TP 54,40.4 54,41.6 53.3,42.3 53.3,45.18 JP5.1
!SS_433  (via drill 0.3)
  Top 0.15: U2.14 59.8,2.7 58.5,4 58.5,13.4 58.1,13.8 48,13.8 46.3,15.5 46.3,17.4 v46,17.7 | v43.6,30.2 43.6,33.26 JP11.2
  Bottom 0.15: v46,17.7 44.5,17.7 43.9,18.3 43.9,29.7 43.6,30 v43.6,30.2
!SS_RFM12  (via drill 0.3)
  Top 0.15: U4.14 62.18,34.02 v62.1,34.1 | v49,34.7 46.3,37.4 JP11.1
  Bottom 0.15: v62.1,34.1 61.5,34.7 60.5,34.7 59.8,35.4 49.7,35.4 v49,34.7
!SS_ZWAVE
  Top 0.15: U6.5 39.65,19.65 40.6,20.6 40.6,30.92 JP11.3
ANT_433
  Top 0.5: TP1.TP U2.8
  Bottom 0.5: U13.P$3 42,2.5 43,1.5 TP1.TP 43.75,1.5
ANT_866
  Bottom 0.5: U1.8 TP5.TP 71,32.7 U11.P$3
ANT_RFM12
  Top 0.5: U4.8 71.38,22.02 TP9.TP
  Bottom 0.5: U14.P$3 69.38,22 TP9.TP
DC_433  (via drill 0.3)
  Top 0.15: U2.6 v49.8,15.5
  Bottom 0.15: v49.8,15.5 49.8,18.1 TP3.TP
DC_868  (via drill 0.3)
  Top 0.15: v69.8,52 68.7,52 68.1,51.4 65.8,51.4 65,50.6 56,50.6 55.4,50 55.4,45.5 55.7,45.2 v55.7,44.9
  Bottom 0.15: U1.6 v69.8,52 | v55.7,44.9 55.7,44.3 TP6.TP
DD/_868  (via drill 0.3)
  Top 0.15: v67.8,52 65.9,52 64.9,51 55.9,51 55.1,50.2 55.1,44.7 54.2,43.8 54.2,42.7 v54,42.5
  Bottom 0.15: U1.5 v67.8,52 | v54,42.5 54,42.3 54.8,41.5 TP7.TP
DD_433  (via drill 0.3)
  Top 0.15: U2.5 v51.8,15.4
  Bottom 0.15: v51.8,15.4 51.8,18.1 TP4.TP
EN0_ANT
  Top 0.5: U5.4 10.15,2.5 TP10.TP
ENO_PROG_EN  (via drill 0.3)
  Top 0.15: U5.18 v19,23.5 | JP9.1 22.1,9 22.1,17.6 22.9,18.4 v22.9,18.7
  Bottom 0.15: v19,23.5 21.1,23.5 | 21.1,23.5 R3.2 | v22.9,18.7 22.4,19.2 22.4,21.6 21.1,22.9 21.1,23.5
ENO_RESET  (via drill 0.3)
  Top 0.15: U5.27 3.95,18.4 4.45,17.9 v4.8,17.9 | JP9.2 21.8,6.76 21.8,18.3 22,18.5 v22,18.7
  Bottom 0.15: v4.8,17.9 6.97,17.9 R2.1 7,19.8 7.9,20.7 8.5,20.7 8.8,20.4 11.2,20.4 12.9,18.7 v22,18.7
ENO_SER_RX  (via drill 0.3)
  Top 0.15: v9.7,9 10.4,9 10.85,9.45 16.95,9.45 17.6,10.1 17.6,16 18.2,16.6 U5.15
  Bottom 0.15: U3.12 9.43,9.28 v9.7,9
ENO_SER_TX  (via drill 0.3)
  Top 0.15: v9.7,10.2 10.4,10.2 10.85,9.75 16.75,9.75 17.3,10.3 17.3,17.9 17.8,18.4 U5.16
  Bottom 0.15: U3.13 9.43,9.93 v9.7,10.2
GND  (via drill 0.3, 0.4)
  Bottom 0.406: v53,6 52,6 BAT.GND
  other vias: 51,8 51,6 53,8 15,40.3 19.9,37.7 31.4,37.1 35.5,49.5 34.9,42 2,33 6,40 2,22 5.5,11.5 1.25,2.8 8.5,3.5 22.5,1.5 31,3 34.5,1.5 41.5,1 60.5,3 59.35,10.8 56,13.2 42,14.5 33,14 34,21 36,28 39,26 59,32 59,29 63.5,24 71,25 67.85,35.25 67,39.5 59.1,45.5 53.1,40.3 52,37 57.5,34 49,32 45.5,33.45 67,45.5 23,12.5 23,17 23.1,20.2 24.1,23.5 45.5,25 45.5,21 10.2,37.1 12.7,37.1 17.6,34.6 37.1,35.8 36.55,32.25 7,7.05 10.7,5.7 17.3,5.7 41.5,6.5 63.5,21 65.5,19.3 61,24 56.8,24.5 54.6,21 49.2,21.7 11,30.95 14,28.5 45.5,19 36.8,42.1 21.8,20.2 13.3,16.1 28.4,17.9 18.5,22.6 22.6,39.7 12.1,40.5 9.3,18 5.4,20.6 10.6,21.3 14.5,21 16.4,11.7 31,8.5 31,7 29.5,5 36,4 36,1.5 34.5,9 31,11.5 33,11.5 29,10 39,5.5 71.5,19.3 71,28 70.75,35.3 72.5,26.5 72.5,23.5 72.5,20.5 61,21 73.5,52 73.5,49 73.5,45.5 73.5,42 73.5,39.5 55.6,52.4 61,49.5 67,50.5 61,45.5 61,42 49.5,40.3 50,37 45.5,35.5 61,28 54.5,31 57,27 63.5,28 50.5,23.5 45.5,23 49,14.5 46,14.5 42,11 46,11 39.5,13 38.5,9.5 25,6.5 22.5,4 4.5,7 5,16 8.5,16 2,25.5 6.5,26 9,40 3.5,40 3.5,35 35.5,54 39,54 39,45.5 39,49.5 35.5,45.5 39.5,30 31.5,18.5 27,10 27,14 29,14 31,14 25,1.5 25,4 27,6.5 39.5,18 43.8,38.1 39.9,37.5 37.1,38.8 52.9,41.7 55.6,54.3 64,33 62.8,35.2 64,31.1
  pour Bottom: 64,16.75 64,1 arc-90 63,0 1,0 arc-90 0,1 0,25.2 34,25.2 34,34.7 21,34.7 21,25.3 0,25.3 0,54 arc-90 1,55 39.25,55 arc-90 40.25,54 40.25,42.75 arc90 41.25,41.75 51,41.75 arc90 52,42.75 52,54 arc-90 53,55 84,55 arc-90 85,54 85,38.15 arc-90 84,37.15 74.5,37.15 arc90 73.5,36.15 73.5,18.75 arc-90 72.5,17.75 65,17.75 arc90
  pour Top: 64,16.75 64,1 arc-90 63,0 1,0 arc-90 0,1 0,24.2 21.1,24.2 21.1,25.2 34,25.2 34,34.7 21,34.7 21,24.3 0,24.3 0,54 arc-90 1,55 39.25,55 arc-90 40.25,54 40.25,42.75 arc90 41.25,41.75 51,41.75 arc90 52,42.75 52,54 arc-90 53,55 84,55 arc-90 85,54 85,38.15 arc-90 84,37.15 74.5,37.15 arc90 73.5,36.15 73.5,18.75 arc-90 72.5,17.75 65,17.75 arc90
GP0
  Bottom 0.254: SV1.11 13.9,49.05 13.9,43.93 SV2.11
GP1  (via drill 0.3)
  Top 0.15: SV2.12 16.4,43.97 v16.4,40.6
  Top 0.254: SV1.12 13.9,51.59 13.9,46.47 SV2.12
  Bottom 0.15: LED1.C 19.75,36.75 18.96,37.54 EN_LED.2 17.5,39.4 | v16.4,40.6 16.4,40.5 17.5,39.4 | 17.5,39.4 EN_LED.1
GP2
  Bottom 0.254: SV1.13 16.4,49.01 16.4,43.97 SV2.13
GP3
  Bottom 0.254: SV1.15 18.9,48.97 18.9,44.01 SV2.15
GP4
  Top 0.254: SV1.16 18.9,51.51 18.9,46.55 SV2.16
GP5
  Top 0.254: SV1.18 21.5,51.57 21.5,46.49 SV2.18
GP7
  Bottom 0.254: SV1.7 8.8,49.03 8.8,43.95 SV2.7
IRQ/RX_433
  Top 0.15: U2.2 57.8,19.3 56.9,20.2 43.74,20.2 42,21.94 JP2.2 JP5.8.1
IRQ/RX_868  (via drill 0.3)
  Top 0.15: v61.8,52 61.8,52.7 61.2,53.3 55.2,53.3 54.8,52.9 54.8,51.76 JP1.2 | JP7.1 54.48,47.92 54.8,47.6 54.8,44.9 54,44.1 52.9,44.1 52.4,43.6 52.4,42.1 51.7,41.4 40.6,41.4 39.9,42.1 39.9,42.9 39.1,43.7 EN_IRQ_868.1 EN_IRQ_868.2 35.5,43.7 34.6,44.6 34.6,53.1 33.6,54.1 29.11,54.1 SV1.22
  Top 0.254: SV1.22 26.6,51.59 26.6,46.47 SV2.22
  Bottom 0.15: U1.2 v61.8,52 | JP1.2 JP7.1
LED
  Bottom 0.15: LED1.A 28.75,35.8 31.1,35.8 R1.1
MISO  (via drill 0.3)
  Top 0.15: v61.8,38.7 61.8,36.7 60.7,35.6 60.7,34.5 | U2.1 60.9,18 62,19.1 62,30.8 60.7,32.1 60.7,33 | 60.7,33 60.7,34.5 | U4.1 52.64,34 53.7,34 54.7,33 60.7,33 | 60.7,34.5 59.8,35.4 58,35.4 54.9,38.5 49,38.5 48.1,39.4 v47.5,39.4 | U6.7 34.1,23.95 v34.1,22.3 | v35.6,37.5 v35.6,40.8
  Bottom 0.15: U1.1 59.8,40.7 v61.8,38.7 | 26.6,43.93 30.03,40.5 35.6,40.5 | 35.6,40.5 45.6,40.5 46.7,39.4 v47.5,39.4 | v34.1,22.3 34.6,22.8 34.6,36.5 v35.6,37.5 | v35.6,40.8 35.6,40.5
  Bottom 0.254: SV1.21 26.6,49.05 26.6,43.93 SV2.21
MOSI  (via drill 0.3)
  Top 0.15: U2.12 55.8,2.6 57.1,3.9 57.1,12.1 57.5,12.5 v57.8,12.5 | v61.9,18.1 62.3,18.5 62.3,31.4 v61.3,32.4 | v58.6,34.3 54.7,38.2 48.8,38.2 48.5,38.5 v47.5,38.5 | U6.9 31.1,23.95 v31.1,22.3 | v33,39.9 v33,37.5 | U4.12 68.6,30 v66.9,30
  Bottom 0.15: U1.12 63.8,34.9 62.3,33.4 62,33.4 61.3,32.7 | v57.8,12.5 58.5,11.8 61.8,11.8 62.3,12.3 62.3,17.7 v61.9,18.1 | 61.3,32.7 v61.3,32.4 63.7,30 v66.9,30 | 33,40.2 45.45,40.2 47.15,38.5 v47.5,38.5 | 61.3,32.7 59.7,34.3 v58.6,34.3 | v31.1,22.3 34,25.2 34,36.5 v33,37.5 | 33,40.2 27.8,40.2 SV2.19 | 33,40.2 v33,39.9
  Bottom 0.254: SV1.19 24,48.99 24,43.99 SV2.19
N$3
  Top 0.5: TP11.TP C13.2 L1.2
  Bottom 0.5: U15.P$3 32.7,1.55 TP11.TP
PWR_IN
  Top 0.61: J1.PWR 9.7,29.2 10,29.5 10,34.03 JP8.3
RF_50  (via drill 0.3)
  Top 0.5: U5.6 15.1,3.6 v16.5,5
  Bottom 0.5: v16.5,5 16,5 15,4 U12.P$3
RFIN/OUT
  Top 0.5: L1.1 C12.2 U6.18
RTC_VBATT
  Bottom 0.254: U9.3 56.95,25.75 57.8,24.9 57.8,20.8 59,19.6 62.4,19.6 63.6,18.4 63.6,8.2 62.4,7 BAT.PWR@2
RTC_X1
  Bottom 0.15: U9.1 54.8,29.3 55.75,30.25 55.95,30.25 56.2,30.5 Q3.1
RTC_X2
  Bottom 0.15: U9.2 53.59,27.02 52.9,27.7 52.9,31.9 54.7,33.7 Q3.4
RXD  (via drill 0.3)
  Top 0.15: SV2.10 13.9,43.93 13.9,41.2 11.7,39 11.7,32.5 v12.3,31.9
  Top 0.254: SV1.10 11.3,51.53 11.3,46.53 SV2.10
  Bottom 0.15: U8.2 13.1,20 12.7,20.4 12.7,29.5 11.6,30.6 11.6,31.2 v12.3,31.9
RXD_ZWAVE  (via drill 0.3)
  Top 0.15: v30.3,16.6 30.3,16 31,15.3 34.7,15.3 35.1,14.9 35.1,11.6 36.5,10.2 JP3.2 | U6.10 29.5,23.85 v29.5,22.3
  Bottom 0.15: v29.5,22.3 29.5,22.2 30.3,21.4 v30.3,16.6
SC16_!IRQ  (via drill 0.3)  (1 unrouted)
  Top 0.15: v26.2,17.5 26.5,17.2 33.2,17.2 33.3,17.1 v33.7,17.1
  Bottom 0.15: U3.7 16.05,7.97 R4.2 16.32,8.2 16.9,8.2 17.6,8.9 17.6,17.1 18.1,17.6 26.1,17.6 v26.2,17.5 | v33.7,17.1 43.1,17.1 43.6,17.6 43.6,28.4 42.2,29.8 42,29.8
SC16_XTAL1
  Bottom 0.15: U3.15 7.55,11.22 C4.2 6.47,10.68 5.1,9.3 3,9.3 | Q2.3 3,9.55 3,9.3 | 3,9.3 3,7.2 Q1.P$2
SC16_XTAL2
  Bottom 0.15: U3.16 7.55,11.88 C3.2 6.38,12.43 5,13.8 3,13.8 3,15.8 Q1.P$1 3,13.45 Q2.1
SCL  (via drill 0.3)
  Top 0.15: v47.8,25.7 47.8,26.3 49.1,27.6 v49.1,30.2 | v12.6,10.8 12.6,11 12.3,11.3 12.3,16 17.6,21.3 18.8,21.3 20.9,23.4 20.9,40.4 v21.3,40.8
  Bottom 0.15: U7.1 52.1,23.25 52.1,25.2 51.55,25.75 U9.6 47.84,25.75 v47.8,25.7 | SV2.5 8.7,41.5 21.3,41.5 | 21.3,41.5 25.5,41.5 27.2,39.8 32.2,39.8 32.7,39.3 33.3,39.3 33.8,39.8 45.3,39.8 48.2,36.9 48.2,31.1 v49.1,30.2 | U3.5 12.93,9.28 12.6,9.6 v12.6,10.8 | v21.3,40.8 21.3,41.5
  Bottom 0.254: SV1.5 6.2,48.97 6.2,44.01 SV2.5
SCLK  (via drill 0.3)
  Top 0.15: U2.13 v57.8,11.5 | v62.9,18.1 62.6,18.4 62.6,32 62.58,32.02 | 62.58,32.02 61.1,33.5 61.1,34.8 v61.8,35.5 | U4.13 62.58,32.02 | v58,36.3 57.6,36.3 55.1,38.8 49.2,38.8 47.7,40.3 v47.5,40.3 | U6.8 32.6,23.95 v32.6,22.3 | v34.3,37.5 v34.3,41.1
  Bottom 0.15: U1.13 v61.8,35.5 61.5,35.8 58.5,35.8 v58,36.3 | v57.8,11.5 62,11.5 62.6,12.1 62.6,17.8 v62.9,18.1 | 29.1,43.97 32.27,40.8 34.3,40.8 | 34.3,40.8 34.7,40.8 35.3,41.4 35.9,41.4 36.5,40.8 45.75,40.8 46.25,40.3 v47.5,40.3 | v32.6,22.3 34.3,24 v34.3,37.5 | v34.3,41.1 34.3,40.8
  Bottom 0.254: SV1.23 29.1,49.01 29.1,43.97 SV2.23
SDA  (via drill 0.3)
  Top 0.15: v48.2,30.2 48.2,27.2 47.1,26.1 47.1,25.1 v47.7,24.5 | v11.7,10.8 11.7,11 12,11.3 12,16.15 17.45,21.6 18.6,21.6 20.6,23.6 20.6,40.4 v20.2,40.8
  Bottom 0.15: U7.6 49.56,23.19 U9.5 49.54,24.5 v47.7,24.5 | SV2.3 6.47,41.2 19.8,41.2 v20.2,40.8 20.8,40.2 21.7,40.2 22.7,41.2 25.3,41.2 27,39.5 32,39.5 32.5,39 33.5,39 34,39.5 45.1,39.5 47.8,36.8 47.8,30.6 v48.2,30.2 | U3.6 12.18,8.62 11.7,9.1 v11.7,10.8
  Bottom 0.254: SV1.3 3.7,49.01 3.7,43.97 SV2.3
SPI_0  (via drill 0.3)
  Top 0.15: SV2.24 31.71,43.9 33.9,43.9 36.7,41.1 58.9,41.1 59.8,40.2 v59.8,38.8
  Top 0.254: SV1.24 29.1,51.55 29.1,46.51 SV2.24
  Bottom 0.15: v59.8,38.8 U1.14
SPI_1
  Top 0.254: SV1.26 31.7,51.61 31.7,46.45 SV2.26
TX_433
  Top 0.15: U2.3 55.8,19.3 55.2,19.9 42.28,19.9 JP2.1
TX_868  (via drill 0.3)
  Top 0.15: v63.8,52 63.8,53.1 63.3,53.6 54.1,53.6 JP1.1
  Bottom 0.15: U1.3 v63.8,52
TXD  (via drill 0.3)
  Top 0.15: SV2.8 11.4,43.89 11.4,31.7 v12.3,30.8
  Top 0.254: SV1.8 8.8,51.57 8.8,46.49 SV2.8
  Bottom 0.15: U8.3 13,23.5 13,30.1 v12.3,30.8
TXD_ZWAVE
  Top 0.15: U6.15 28.95,16.65 30.6,15 34.5,15 34.8,14.7 34.8,11.4 36.2,10 36.2,9.5 35.2,8.5 35.2,6.7 36.4,5.5 JP3.1
VCC_EVE
  Bottom 0.61: U10.3 22.05,25.6 C8.1 21.95,26.55 18.5,30 17,30 15,32 13.5,32 9,36.5 9,37.5 8.5,38 6.49,38 JP8.2

### Text on the board
tPlace: 868Mhz | c | 2012 | RFM12B | Z-Wave | EnOcean | 433Mhz
bPlace: DC | DD | !SerEn | LED EN | Pi | Pwr | Ext | !Reset | DC | DD | !SerEn | !Reset | EVEALPHA.org
Document: TX 868 | RX 868 | IRQ 868 | 5V0 | 5V0 | GND | TXD | RXD | G18 | GND | G23 | G24 | GND | G25 | CE0 | CE1 | GPIO 25 | IRQ 868 | !SERIAL EN! 868 | 3V3 | SDA | SCL | G04 | GND | G17 | G21 | !G27 | G22 | 3V3 | MOSI | MISO | SCK | GND | RoHS | IoT Research | v0.3 | !SS RFM12 | !SS 433 | !SS Z-Wave | ALPHA | IRQ SC16 | Thank You Kickstarter | IRQ RFM12 | http://kck.st/SzABKc | IRQ 433 | RX 433 | TX 433 | EnO ProgEn | RX Z-Wave | EnO Reset | TX Z-Wave